# Altium schematic sheet Power.SchDoc
size A4; SheetNumber: 4; SheetTotal: 9
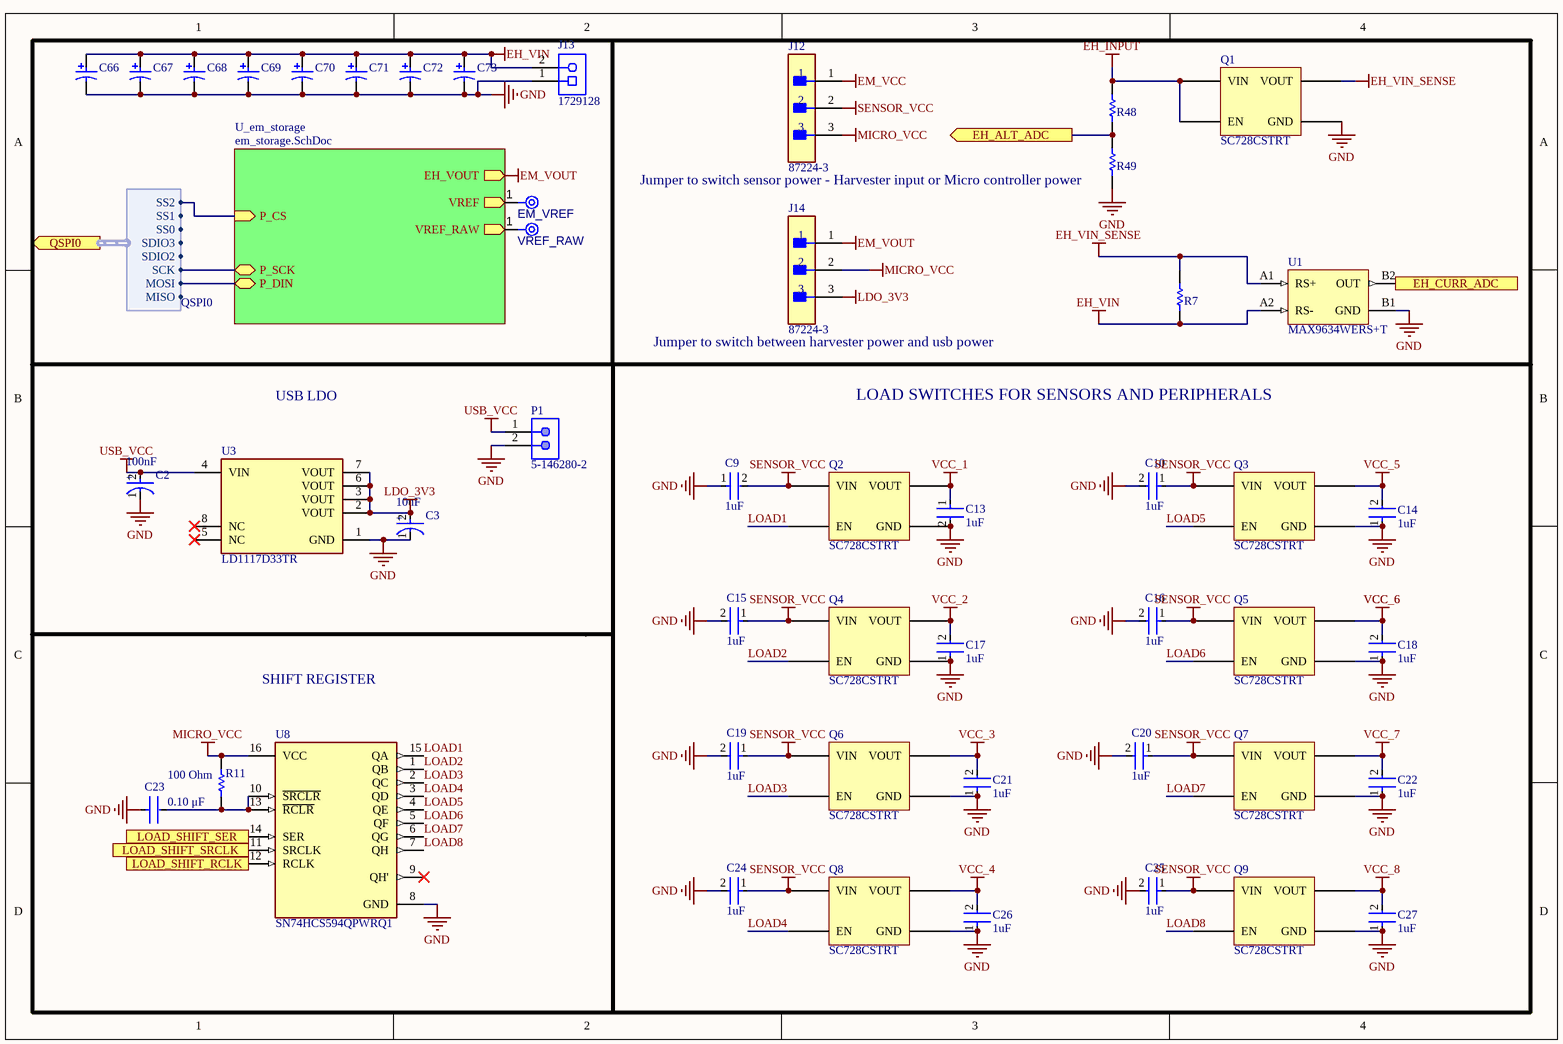
[diagram p0: Power.SchDoc]

## Parts
C2  Capacitance: 100nF  [FP-T491A104K035AT-MFG]  (hidden comment: T491A104K035AT)
C3  Capacitance: 10uF  [FP-TAJA-MFG]  (hidden comment: TAJA106K006RNJ)
C9  Capacitance: 1uF  [FP-GRM15-0_1-MFG]  (hidden comment: GRT155R61C105KE01J)
C10  Capacitance: 1uF  [FP-GRM15-0_1-MFG]  (hidden comment: GRT155R61C105KE01J)
C13  Capacitance: 1uF  [FP-GRM15-0_1-MFG]  (hidden comment: GRT155R61C105KE01J)
C14  Capacitance: 1uF  [FP-GRM15-0_1-MFG]  (hidden comment: GRT155R61C105KE01J)
C15  Capacitance: 1uF  [FP-GRM15-0_1-MFG]  (hidden comment: GRT155R61C105KE01J)
C16  Capacitance: 1uF  [FP-GRM15-0_1-MFG]  (hidden comment: GRT155R61C105KE01J)
C17  Capacitance: 1uF  [FP-GRM15-0_1-MFG]  (hidden comment: GRT155R61C105KE01J)
C18  Capacitance: 1uF  [FP-GRM15-0_1-MFG]  (hidden comment: GRT155R61C105KE01J)
C19  Capacitance: 1uF  [FP-GRM15-0_1-MFG]  (hidden comment: GRT155R61C105KE01J)
C20  Capacitance: 1uF  [FP-GRM15-0_1-MFG]  (hidden comment: GRT155R61C105KE01J)
C21  Capacitance: 1uF  [FP-GRM15-0_1-MFG]  (hidden comment: GRT155R61C105KE01J)
C22  Capacitance: 1uF  [FP-GRM15-0_1-MFG]  (hidden comment: GRT155R61C105KE01J)
C23  Capacitance: 0.10 μF  [FP-C0402-BB-MFG]  (hidden comment: C0402C104K8PACTU)
C24  Capacitance: 1uF  [FP-GRM15-0_1-MFG]  (hidden comment: GRT155R61C105KE01J)
C25  Capacitance: 1uF  [FP-GRM15-0_1-MFG]  (hidden comment: GRT155R61C105KE01J)
C26  Capacitance: 1uF  [FP-GRM15-0_1-MFG]  (hidden comment: GRT155R61C105KE01J)
C27  Capacitance: 1uF  [FP-GRM15-0_1-MFG]  (hidden comment: GRT155R61C105KE01J)
C66  T491D106K025AT  [KEMT-T491-D_L]  (value not drawn)
C67  T491D106K025AT  [KEMT-T491-D_L]  (value not drawn)
C68  T491D106K025AT  [KEMT-T491-D_L]  (value not drawn)
C69  T491D106K025AT  [KEMT-T491-D_L]  (value not drawn)
C70  T491D106K025AT  [KEMT-T491-D_L]  (value not drawn)
C71  T491D106K025AT  [KEMT-T491-D_L]  (value not drawn)
C72  T491D106K025AT  [KEMT-T491-D_L]  (value not drawn)
C73  T491D106K025AT  [KEMT-T491-D_L]  (value not drawn)
EM_VREF  TPAD6R  [TP06R]  (value not drawn)  (no BOM)
J12  87224-3  [FP-87224-3-MFG]
J13  1729128  [PHOE-1729128-2_V]
J14  87224-3  [FP-87224-3-MFG]
P1  5-146280-2  [TECO-5-146280-2_V]
Q1  SC728CSTRT  [PCBComponent_1]
Q2  SC728CSTRT  [PCBComponent_1]
Q3  SC728CSTRT  [PCBComponent_1]
Q4  SC728CSTRT  [PCBComponent_1]
Q5  SC728CSTRT  [PCBComponent_1]
Q6  SC728CSTRT  [PCBComponent_1]
Q7  SC728CSTRT  [PCBComponent_1]
Q8  SC728CSTRT  [PCBComponent_1]
Q9  SC728CSTRT  [PCBComponent_1]
R7  WSL0603R0300FEA18  [RESC1508X46X38ML25T25]  (value not drawn)
R11  Resistance: 100 Ohm  [RESC1005X40X25LL05T05]  (hidden comment: ERJ-2RKF1000X)
R48  RC0402FR-071ML  [RESC1005X40X25NL05T10]  (value not drawn)
R49  RC0402FR-071ML  [RESC1005X40X25NL05T10]  (value not drawn)
U1  MAX9634WERS+T  [MAXM-R41A1+1]
U3  LD1117D33TR  [FP-SO-8-0016023-MFG]
U8  SN74HCS594QPWRQ1  [FP-PW0016A-IPC_A]
VREF_RAW  TPAD6R  [TP06R]  (value not drawn)  (no BOM)

## Sub-sheets
U_em_storage = em_storage.SchDoc: P_SCK (bidir), P_DIN (bidir), P_CS (in), VREF_RAW (out), VREF (out), EH_VOUT (out)

## Ports
EH_ALT_ADC (out), EH_CURR_ADC (out), LOAD_SHIFT_RCLK (in), LOAD_SHIFT_SER (in), LOAD_SHIFT_SRCLK (in), QSPI0 (out, harness QSPI0)

## Harnesses
QSPI0: MISO, MOSI, SCK, SDIO2, SDIO3, SS0, SS1, SS2

## Nets
EH_INPUT: Q1.A2(VIN) Q1.B2(EN) R48.2
EH_VIN: C66.1 C67.1 C68.1 C69.1 C70.1 C71.1 C72.1 C73.1 J13.2 R7.1 U1.A2(RS-)
EH_VIN_SENSE: Q1.A1(VOUT) R7.2 U1.A1(RS+)
EM_VCC: J12.1
EM_VOUT: J14.1 ; sheet U_em_storage/EH_VOUT
GND: C2.1(C) C3.1(C) C9.1 C10.2 C13.2 C14.1 C15.2 C16.2 C17.1 C18.1 C19.2 C20.2 C21.1 C22.1 C23.1 C24.2 C25.2 C26.1 C27.1 C66.2 C67.2 C68.2 C69.2 C70.2 C71.2 C72.2 C73.2 J13.1 P1.2 Q1.B1(GND) Q2.B1(GND) Q3.B1(GND) Q4.B1(GND) Q5.B1(GND) Q6.B1(GND) Q7.B1(GND) Q8.B1(GND) Q9.B1(GND) R49.1 U1.B1(GND) U3.1(GND) U8.8(GND)
LDO_3V3: C3.2(A) J14.3 U3.2(VOUT) U3.3(VOUT) U3.6(VOUT) U3.7(VOUT)
MICRO_VCC: J12.3 J14.2 R11.2 U8.16(VCC)
SENSOR_VCC: C9.2 C10.1 C15.1 C16.1 C19.1 C20.1 C24.1 C25.1 J12.2 Q2.A2(VIN) Q3.A2(VIN) Q4.A2(VIN) Q5.A2(VIN) Q6.A2(VIN) Q7.A2(VIN) Q8.A2(VIN) Q9.A2(VIN)
USB_VCC: C2.2(A) P1.1 U3.4(VIN)
VCC_1: C13.1 Q2.A1(VOUT)
VCC_2: C17.2 Q4.A1(VOUT)
VCC_3: C21.2 Q6.A1(VOUT)
VCC_4: C26.2 Q8.A1(VOUT)
VCC_5: C14.2 Q3.A1(VOUT)
VCC_6: C18.2 Q5.A1(VOUT)
VCC_7: C22.2 Q7.A1(VOUT)
VCC_8: C27.2 Q9.A1(VOUT)
EH_ALT_ADC: R48.1 R49.2 ; port EH_ALT_ADC
EH_CURR_ADC: U1.B2(OUT) ; port EH_CURR_ADC
LOAD1: Q2.B2(EN) U8.15(QA)
LOAD2: Q4.B2(EN) U8.1(QB)
LOAD3: Q6.B2(EN) U8.2(QC)
LOAD4: Q8.B2(EN) U8.3(QD)
LOAD5: Q3.B2(EN) U8.4(QE)
LOAD6: Q5.B2(EN) U8.5(QF)
LOAD7: Q7.B2(EN) U8.6(QG)
LOAD8: Q9.B2(EN) U8.7(QH)
LOAD_SHIFT_RCLK: U8.12(RCLK) ; port LOAD_SHIFT_RCLK
LOAD_SHIFT_SER: U8.14(SER) ; port LOAD_SHIFT_SER
LOAD_SHIFT_SRCLK: U8.11(SRCLK) ; port LOAD_SHIFT_SRCLK
NetC23_2: C23.2 R11.1 U8.10(~{SRCLR}) U8.13(~{RCLR})
NetEM_VREF_1: EM_VREF.1(TP) ; sheet U_em_storage/VREF
NetVREF_RAW_1: VREF_RAW.1(TP) ; sheet U_em_storage/VREF_RAW
(unnamed): sheet U_em_storage/P_SCK, port QSPI0.SCK
(unnamed): sheet U_em_storage/P_DIN, port QSPI0.MOSI
(unnamed): sheet U_em_storage/P_CS, port QSPI0.SS2

Not connected (* = marked no-connect by the designer): U3 5(NC)* 8(NC)*; U8 9(QH')*

## Notes on the sheet
- (near R49) Jumper to switch sensor power - Harvester input or Micro controller power
- (near J14) Jumper to switch between harvester power and usb power
- USB LDO
- LOAD SWITCHES FOR SENSORS AND PERIPHERALS
- SHIFT REGISTER
- (in symbol CMP-03017-000018-1) +
- (in symbol CMP-04424-000097-1) +

## Library data of the parts
C2 = CMP-03017-000018-1: CAP TANT 0.1UF 10% 35V 1206; Dissipation Factor: 4%; ESR (Equivalent Series Resistance): 20R; Polarity: Polar; Dielectric Material: Tantalum; Leakage Current: 500nA; Ripple Current: 61mA; Life (Hours): 2000Hour; Width: 1.6mm; Radiation Hardening: No; Lead Free: Lead Free; Case Code (Metric): 3216; REACH SVHC: No SVHC; Termination: SMD/SMT; Tolerance: 10%; Height - Seated (Max): 0.071inch; Series: T491; Features: General Purpose; Lead Pitch: 1.2mm; RoHS Compliant: Yes; Number of Pins: 2; Voltage: 35V; Packaging: Tape and Reel; Depth: 1.6mm; Length: 3.2mm; Case Code (Imperial): 1206; Construction: Flat; Min Operating Temperature: -55°C; Max Operating Temperature: 125°C; Height: 1.6mm; Voltage Rating: 35V; Case/Package: 1206; Package Quantity: 1; Weight: 0.000571oz; Size: 1.6mm; Voltage Rating (DC): 35V; Mount: Surface Mount
C3 = CMP-04424-000097-1: 10uF 6.3V  ±10% 4Ω 1206  SMD Tantalum Capacitor; Leakage Current: 600nA; Q Factor: 6; Polarity: Polar; ESR (Equivalent Series Resistance): 4R; Dissipation Factor: 6%; Tolerance: 20%; Lead Free: Lead Free; Min Operating Temperature: -55°C; Case/Package: 1206; Voltage Rating (DC): 6.3V; Mount: Surface Mount; Termination: SMD/SMT; Depth: 1.6mm; Height: 1.6mm; Voltage: 6.3V; Features: General Purpose; Series: TAJ; Voltage Rating: 6.3V; Package Quantity: 1; Max Operating Temperature: 125°C; Width: 1.6mm; Length: 3.2mm; Construction: Flat; REACH SVHC: No SVHC; Case Code (Imperial): 1206; Radiation Hardening: No; RoHS Compliant: Yes; Dielectric Material: Tantalum; Height - Seated (Max): 0.071inch; Case Code (Metric): 3216; Packaging: Tape and Reel
C9 C10 C13-C22 C24-C27 = CMP-2008-04556-2: CAP CER 1UF 10V X5R 0402; Manufacturer Part Number: GRM155R61A105KE15D; Manufacturer: Murata; Material: Ceramic; Tolerance: 10%; Temperature Coefficient: 15%; Octopart: https://octopart.com/grm155r61a105ke15d-murata-197442; Lead Free: Yes; ComponentLink2Description: Datasheet; Temperature: -55°C to +85°C; Temperature Range High: +85°C; Height: 0.55mm; Ipc Land Pattern Name: CAPC10050X50; ComponentLink2URL: https://search.murata.co.jp/Ceramy/image/img/A01X/G101/ENG/GRM155R61A105KE15-01A.pdf; Temperature Range Low: -55°C; Device Class L2: Capacitors; Voltage Rating: 10V; RoHS: TRUE; Device Class L1: Passive Components; Device Class L3: Ceramic Capacitors; Temperature Characteristic: X5R; Mouser Description: 0402 1 uF 10 V ±10% Tolerance X5R Surface Mount Multilayer Ceramic Capacitor; Automotive: No; Package: GRM15-0.1; Digikey Description: CAP CER 1UF 10V X5R 0402; Value: 1uF; Category: Cap
C23 = CMP-2008-02046-2: CAP CER 0.1UF 10V X5R 0402; Manufacturer: Kemet; Material: Ceramic; Temperature Coefficient: 15%; Tolerance: 0.1; Value: 0.10 μF; Package: C0402-BB; Temperature: -55°C to +125°C; ComponentLink2Description: Datasheet; Temperature Characteristic: X5R; Device Class L1: Passive Components; Height: 0.55mm; Lead Free: Yes; ComponentLink2URL: https://content.kemet.com/datasheets/KEM_C1002_X7R_SMD.pdf; Device Class L2: Capacitors; Temperature Range Low: -55°C; Temperature Range High: +125°C; RoHS: TRUE; Octopart: https://octopart.com/c0402c104k8pactu-kemet-140039; Automotive: No; Mouser Description: Capacitor 100 nF 10 VDC 0402; Category: Cap; Voltage Rating: 10 V; Digikey Description: CAP CER 0.1UF 10V X5R 0402; Ipc Land Pattern Name: CAPC10050X50; Device Class L3: Ceramic Capacitors; Manufacturer Part Number: C0402C104K8PACTU
C66-C73 = CMP-2000-07200-1: Tantalum Capacitor, 10 uF, +/- 10%, 25 V, -55 to 125 degC, 2-Pin SMD, RoHS, Tape and Reel; Manufacturer: Kemet; Insulation: NotRequired; Rad Hardened: No; Case Style: Molded; Polarity: Polar; Product Height (mm): 2.8mm; Capacitance: 10000000pF; Product Length (mm): 7.3mm; DF: 6%; ESR: 1ohm; Product Diameter (mm): NotRequiredmm; Voltage: 25VDC; Product Depth (mm): 4.3mm; DCL: 2.5uA; Mounting Style: SurfaceMount; Construction: SMTChip; Failure Rate: NotRequired; Operating Temp Range: -55Cto125C; Packaging: TapeandReel; Length W/Weld: NotRequiredmm; Package Reference: T491-D; Datasheet Version: 10/2016; Package / Case: 7343-31; Wire Form: NotRequired; Seated Plane Height: NotRequiredmm; Length W/Weld (max): NotRequiredmm; Package Description: 2-Pin Surface Mount Device, Body 7.3 x 4.3 mm; Tolerance (+ or -): 10%; Manufacturer URL: http://www.kemet.com/; Datasheet URL: http://capacitoredge.kemet.com/capedge2/DataSheet/Datasheet-T491D106K025AT.pdf?pn=T491D106K025AT; Case Code: D; Mounting Technology: SurfaceMount; Seal: NotRequired; Lead Spacing (nom): NotRequiredmm
EM_VREF VREF_RAW = CMP-00028-00002-2: 0.6mm round; Pins: 1
J12 J14 = CMP-2000-05697-2: CONN HEADER VERT 3POS 2.54MM; Number of Positions: 3; Gasket: No (Without); High Speed Serial Data Connector: No; Current Rating: 3A; Contact Post Length: 0.125inch; PCB Thickness: 1.397mm; PCB Mount Retention: Without; Connector Type: Plug; Approvals: CSA; PCB Mounting Orientation: Vertical; Pitch: 2.54mm; Mating Alignment: No (Without); Housing Color: Black; Contact Gender: Male; Length: 7.21mm; Max Operating Temperature: 105°C; Strain Relief: No (Without); Contact Material: Bronze; Row Spacing: 2.54mm; Series: AMPMODU MOD II; Board Standoff: No (Without); Package Quantity: 520; Radiation Hardening: No; Contact Protection: No (Without); Stabilizers: No (Without); Number of Rows: 1; Contact Mating Length: 8.08mm; Contact Shape: Square; Depth: 2.54mm; Contact Current Rating: 3A; Flammability Rating: UL94 V-0; Packaging: Carton; Number of Contacts: 3; Orientation: Straight; Mount: Through Hole; Keyed: No; Contact Type: Male Pin; Housing Material: Thermoplastic; High Temperature Housing: No; ELV: Compliant; Contact Plating: Gold; Termination: Through Hole; Selectively Loaded: No (Without); Lead Free: Lead Free; Min Operating Temperature: -65°C; Mating Connector Lock: No (Without); Color: Black; RoHS Compliant: Yes
J13 = CMP-2000-05815-1: PCB Terminal Block, 13.5 A, 400 V, 2-Pin THD, RoHS, Bulk; Manufacturer: Phoenix Contact; Package Version: 03/2015; No. of Rows: 1; Pitch: 5.08mm; No. of Positions: 2; Voltage Rating: 400V; Current Rating: 13500mA; Manufacturer URL: http://www.phoenixcontact.com/; Datasheet URL: https://datasheet.ciiva.com/16046/1729128-16046181.pdf; RoHS: TRUE; Package URL: https://www.phoenixcontact.com/online/portal/pi/pxc/product_detail_page/!ut/p/b1/3VdJjqNKFDxLH8AFycySyWY2ozFsEPOMMQaDOX1XedGL_1Vdm5YXJleknhSKeBkvI6EA8ncAo3AYoDhBQGco6KN7VURTdemj9us_IEKEZo_YHiPAEWEFmDGOHMORkqKYCORBZxgL7ZoaZYcbFFUZ3fqxSY6GOuxydWUuHqz1ynmMFygu583Bob0Ewr6Sd_l-5m-kAueHiB0jpRwZwe58wwtkpxtMYd_LmGcDRU02dRNEyWt6Y2ti5pSyJ_reIkzIulrqApdnbT11V5jnCKbYNCvhEM1MCpPByat_X379-iThf08CI5GfOPqfBeS3BRoBOdD55AKVv0iLwCMq-2BrzXWSGRH7pUGD9uwXQjiph3xL0DKQwdGa0JImiIOmBNOestqgwTHSSs2oOep-78apyXQBvNi8ZLaFjvjWvcaUEBu0MC6Wbe-d6mB0FAebo2lUWinqYaZs5DAYzV0RP9yitUjnGJ0iI9xhZkT42OCQNUJJhkgWINNQLP2JFP6OpMg3JCVg70jqHT0lvKOnhHf0lPuOnnLf0VPuWx6_dxwUIvwk5WMkT0kLL1mh61l2yZVSzG3pYV_bqo-mj6uMKwKwdnnW8Jh5RTOJzMOA5c-eJDaZQw4mTMPH02PvS_ZAqNVjVTo2WyYLkwH_KU1mmmG5kjRhDqPXLwwVHvVOjCM60-fpXvTDfMGW1PVFVS1r4e4yVDk4ZdNbkUHvqPqQSeian4UD39fNKmachqdJ1NJbyk8rXT9mXTvPk3oE5meulKGgiruPJek-4I9hTT6G8ZLOyRSm2RRVbThERQad5OS28hdt4YW4vG0stgYYzsWsK4_7y6DZMjJSCqri1kyiZR5vD7pwIrNR7QwPHTcLTI5qT7eRlpHrdGiupYlqQDJ7zy_CND8fWWBoLRXxk1RVcXiBQwbTD4Xi7KL-FuO94t9xaqweXzH; PartNumber: 1729128; Package Description: 2-Pin Through Hole Device, Body 8.1 x 10.16 mm, Pitch 5.08 mm; Datasheet Version: 12/2013; Mounting Technology: ThroughHole; Orientation: Horizontal; Package Reference: 1729128-2; Packing: Bulk
P1 = CMP-2000-07492-1: Male Header, Pitch 2.54 mm, 1 x 2 Position, Height 8.21 mm, Tail Length 3.05 mm, -65 to 105 degC, RoHS, Bulk; Manufacturer: TE Connectivity; Mating Connector Lock: No(Without); Number of Positions: 2; Pitch: 2.54mm; PCB Mounting Orientation: Vertical; Keyed: No; Case\/Package: 100; Mating Post Length: 0.23inch; High Temperature Housing: Yes; Max Current Rating: 5A; PCB Thickness: 0.063inch; PCB Mount Retention: Without; Approvals: CSA; Current Rating: 3A; Radiation Hardening: No; Length: 4.67mm; Contact Mating Length: 0.23inch; Connector Type: Header; Number of Rows: 1; Termination Post Length: 0.12inch; Board Standoff: No(Without); Max Operating Temperature: 105degC; Contact Shape: Square; Selectively Loaded: No(Without); Gasket: No(Without); Number of Contacts: 2; Contact Gender: Male; Mating Alignment: No(Without); Manufacturer URL: http://www.te.com/; Datasheet URL: http://www.te.com/commerce/DocumentDelivery/DDEController?Action=showdoc&DocId=Customer+Drawing%7F146280%7FH1%7Fpdf%7FEnglish%7FENG_CD_146280_H1.pdf%7F5-146280-2; Mount: ThroughHole; Orientation: Straight; Packaging: Carton; Package Reference: 5-146280-2; Package Quantity: 500; Stabilizers: No(Without); Row Spacing: 2.54mm; Contact Material: CopperAlloy; Panel Mount Retention: No(Without); Datasheet Version: Rev. H1, 08/2016; Housing Colour: Black; Colour: Black; Package Description: Male Header, Pitch 2.54 mm, 1 x 2 Position, Height 8.21 mm, Tail Length 3.05 mm; Contact Plating: Matte; Housing Material: Polymer; Contact Protection: No(Without); Min Operating Temperature: -65degC; Mounting Technology: ThroughHole; Flammability Rating: UL94V-0; RoHSCompliant: true; Termination: ThroughHole; Depth: 2.34mm; High Speed Serial Data Connector: No
R7 = CMP-2000-03807-1: Manufacturer: Vishay Dale; Part Number: WSL0603R0300FEA18
R11 = CMP-2002-00605-3: Chip Resistor, 100 Ohm, +/- 1%, 100 mW, -55 to 155 degC, 0402 (1005 Metric), RoHS, Tape and Reel; Manufacturer: Basic Passives; Power Rating: 100 mW; Voltage Rating: 50 V; Case\/Package: 0402; Width: 0.5 mm; Pins: 2; ComponentLink2Description: Datasheet; PackageReference: 0402; Height: 0.35 mm; Tolerance: 1%; DatasheetVersion: 04/2015; Case Code (Imperial): 0402; Min Operating Temperature: -55 degC; Radiation Hardening: No; Length: 1 mm; Package Quantity: 10000; PackageDescription: 2-Pin Surface Mount Device, Body 1 x 0.5 mm; Mounting Technology: Surface Mount; Case Code (Metric): 1005; Packaging: Tape and Reel; ComponentLink1URL: http://www.panasonic.com/; RoHSCompliant: true; Max Operating Temperature: 155 degC; REACH SVHC: Yes; PartNumber: ERJ-2RKF1000X; ComponentLink1Description: Manufacturer URL; ComponentLink2URL: http://industrial.panasonic.com/cdbs/www-data/pdf/RDA0000/AOA0000C86.pdf; Mount: Surface Mount
R48 = CMP-2002-07490-1: 3M ohm; Manufacturer: Yageo / Phycomp; Part Number: RC0402FR-071ML
R49 = CMP-2002-07490-1: 1M ohm; Manufacturer: Yageo / Phycomp; Part Number: RC0402FR-071ML
U1 = CMP-0252-00019-2: 1 uA, 4-Bump, Precision Current-Sense Amplifier, 200 V / V Gain, -40 to 85 degC, 4-Pin BGA (R41A1+1), Pb-Free, Tape and Reel; Gain: 25 V/V, 50 V/V ,100 V/V ,200 V/V; Bi-Dir. Curr. Sense: No; ComponentLink2Description: Datasheet; ComponentLink3URL: http://pdfserv.maximintegrated.com/package_dwgs/21-0242.PDF; Mounting Technology: Surface Mount; PackageVersion: Rev. A, 06/2008; ComponentLink2URL: http://datasheets.maximintegrated.com/en/ds/MAX9634.pdf; ComponentLink1URL: http://www.maximintegrated.com/; PartNumber: MAX9634WERS+T; PackageDescription: 4-Pin Ultra Chip-Scale Package, Body 1 x 1 mm, Pitch 0.5 mm; ComponentLink3Description: Package Specification; ComponentLink1Description: Manufacturer URL; PackageReference: R41A1+1; DatasheetVersion: Rev. 2
U3 = CMP-0244-00261-2: IC REG LINEAR 3.3V 800MA 8SO; Polarity: Positive; Number of Outputs: 1; Quiescent Current: 10mA; Power Dissipation: 12W; Max Output Current: 1.3A; Dropout Voltage: 1.1V; Accuracy: 1%; Input Bias Current: 5mA; Output Type: Fixed; Max Input Voltage: 15V; Min Output Voltage: 3.3V; Width: 4mm; Lead Free: Lead Free; Min Operating Temperature: 0°C; Packaging: Tape and Reel; Output Current: 800mA; Length: 5mm; Output Voltage Accuracy: 1%; Number of Regulators: 1; Max Power Dissipation: 12W; Case/Package: SO; Output Voltage: 3.3V; Number of Pins: 8; Package Quantity: 1; Max Operating Temperature: 150°C; Radiation Hardening: No; Height: 1.65mm; Mount: Surface Mount
U8 = CMP-04904-000006-1: AUTOMOTIVE 8-BIT SHIFT REGISTERS